# Altium schematic sheet Mech.SchDoc
size A4; Organization: Altium Limited; Address1: L3, 12a Rodborough Rd; Address2: Frenchs Forest; Address3: NSW; Address4: Australia 2086
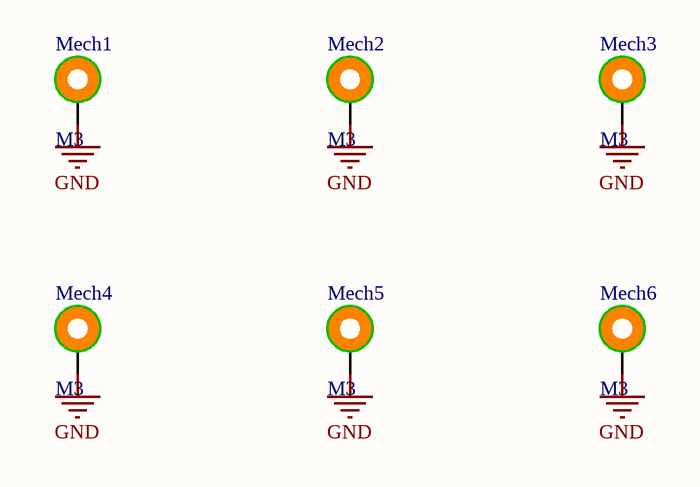
[diagram p0: Mech.SchDoc]

## Parts
Mech1  M3  [PCBPad_M3_Head6mm]
Mech2  M3  [PCBPad_M3_Head6mm]
Mech3  M3  [PCBPad_M3_Head6mm]
Mech4  M3  [PCBPad_M3_Head6mm]
Mech5  M3  [PCBPad_M3_Head6mm]
Mech6  M3  [PCBPad_M3_Head6mm]

## Nets
GND: Mech1.1 Mech2.1 Mech3.1 Mech4.1 Mech5.1 Mech6.1

## Notes on the sheet
- Project Name:
- Revision:
- File Name:
- Date:
- Nuclear Instruments srl
- Via Lecco, 16, Lambrugo, Italy
- +39 031 2289570
- info@nuclearinstruments.eu
- http://www.nuclearinstruments.eu

## Library data of the parts
Mech1-Mech6 = PCBPad_M3_Head6mm